# Altium schematic sheet 15_Debug接口.schdoc.schdoc
size A; Symbol: Sheet-Symbol_A4; Device: Sheet-Symbol_A4; Company: 嘉立创EDA; Version: V1.0; Page Size: A4; @Project Name: RK3568底板_V1.2; @Page Count: 6; @Update Date: 2024-04-19; @Create Date: 2024-04-18; @Schematic Name: 原理图; @Page No: 3; @Page Name: 外设接口
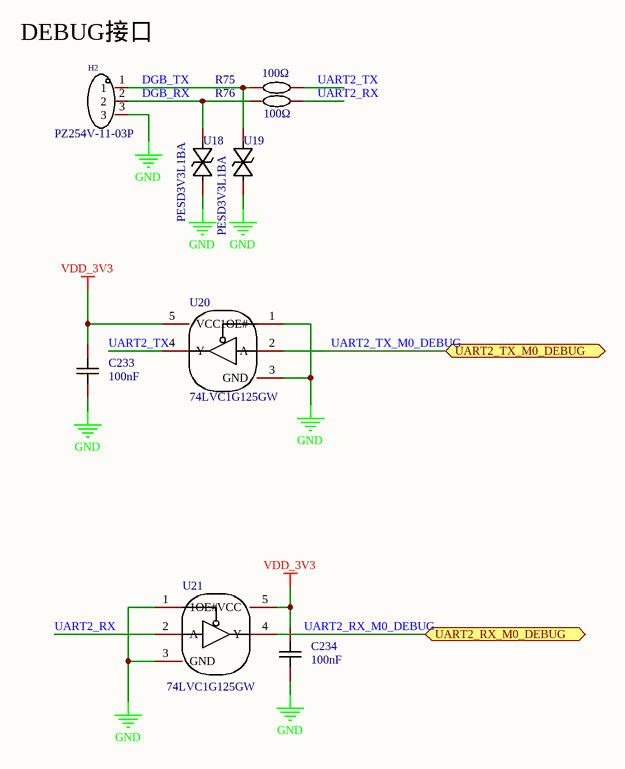
[diagram p0: 15_Debug接口.schdoc.schdoc]

## Parts
C233  100nF  [C0603]
C234  100nF  [C0603]
H2  PZ254V-11-03P  [HDR-TH_3P-P2.54-V-M]
R75  100Ω  [R0603]
R76  100Ω  [R0603]
U18  PESD3V3L1BA  [SOD-323_L1.7-W1.3-LS2.6-BI]
U19  PESD3V3L1BA  [SOD-323_L1.7-W1.3-LS2.6-BI]
U20  Name: 74LVC1G125GW  [SOT-353_L2.1-W1.3-P0.65-LS2.3-BR]  (hidden comment: 74LVC1G125GW,125)
U21  74LVC1G125GW  [SOT-353_L2.1-W1.3-P0.65-LS2.3-BR]

## Ports
UART2_RX_M0_DEBUG (bidir), UART2_TX_M0_DEBUG (bidir)

## Nets
GND: C233.1 C234.1 H2.3 U18.1 U19.1 U20.1(1OE#) U20.3(GND) U21.1(1OE#) U21.3(GND)
VDD_3V3: C233.2 C234.2 U20.5(VCC) U21.5(VCC)
DGB_RX: H2.2 R76.1 U18.2
DGB_TX: H2.1 R75.1 U19.2
UART2_RX: R76.2 U21.2(A)
UART2_RX_M0_DEBUG: U21.4(Y) ; port UART2_RX_M0_DEBUG
UART2_TX: R75.2 U20.4(Y)
UART2_TX_M0_DEBUG: U20.2(A) ; port UART2_TX_M0_DEBUG

## Notes on the sheet
- (near H2) DEBUG接口
- 1
- 2
- 3
- 4
- 5
- 6
- A
- B
- C
- 原理图
- 创建日期
- 更新日期
- 2024-04-19
- 2024-04-18
- 审阅
- 绘制
- 图页
- 外设接口
- 物料编码
- RK3568底板_V1.2
- D
- 版本
- 尺寸
- 页
- 共
- V1.0
- A4
- 嘉立创EDA

## Library data of the parts
C233 C234 = CC0603KRX7R9BB104: Manufacturer: YAGEO(国巨); Add into BOM: yes; Tolerance: ±10%; Voltage Rated: 50V; Temperature Coefficient: X7R; Name: 100nF; Symbol: CC0603KRX7R9BB104; Device: CC0603KRX7R9BB104; Supplier: LCSC; Manufacturer Part: CC0603KRX7R9BB104; Value: 100nF; Supplier Part: C14663; JLCPCB Part Class: 基础库; LCSC Part Name: 100nF ±10% 50V; Supplier Footprint: 0603; Datasheet: https://atta.szlcsc.com/upload/public/pdf/source/20180910/C282072_33301C7F631E79921B82A8DAC6BCC5B3.pdf; Convert to PCB: yes
H2 = PZ254V-11-03P: Manufacturer: XFCN(兴飞); Symbol: PZ254V-11-03P_C2937625; Add into BOM: yes; Pin Structure: 1x3P; Pitch: 2.54mm; Circluar Pins/Square Pins: 方针; Current Rating (Max): 3A; Voltage Rating (Max): 250V; Name: PZ254V-11-03P; Device: PZ254V-11-03P; Supplier: LCSC; Supplier Part: C2937625; Manufacturer Part: PZ254V-11-03P; JLCPCB Part Class: 扩展库; LCSC Part Name: 间距:2.54mm 1x3P 直插 方针; Supplier Footprint: 插件,P=2.54mm; Datasheet: https://atta.szlcsc.com/upload/public/pdf/source/20200309/C492402_8335C3D49C4E4C618838D59BB1D024C1.pdf; Convert to PCB: yes; Row Spacing: -; Mounting Type: 直插; Number of Rows: 单排; Number of Pins: 3P; Length of Mating Pin: 6mm; Insulation Height: 2.5mm; Length of End Connection Pin: 3mm; Operating Temperature Range: -40℃~+105℃; Color: 黑色
R75 R76 = 0603WAF1000T5E: Manufacturer: UNI-ROYAL(厚声); Add into BOM: yes; Tolerance: ±1%; Power(Watts): 100mW; Overload Voltage (Max): 75V; Temperature Coefficient: ±200ppm/℃; Name: 100Ω; Symbol: 0603WAF1000T5E; Device: 0603WAF1000T5E; LCSC Part Name: 100Ω ±1% 100mW 厚膜电阻; Supplier Part: C22775; Manufacturer Part: 0603WAF1000T5E; Supplier Footprint: 0603; JLCPCB Part Class: 基础库; Datasheet: https://atta.szlcsc.com/upload/public/pdf/source/20200306/C422600_1E6D84923E4A46A82E41ADD87F860B5C.pdf; Supplier: LCSC; Convert to PCB: yes; Type: 厚膜电阻; Value: 100Ω; Operating Temperature Range: -55℃~+155℃
U18 U19 = PESD3V3L1BA_C2687129: Manufacturer: UMW(友台半导体); Add into BOM: yes; Name: PESD3V3L1BA; Symbol: PESD3V3L1BA_C2687129; Device: PESD3V3L1BA_C2687129; LCSC Part Name: PESD3V3L1BA; Supplier Part: C2687129; Manufacturer Part: PESD3V3L1BA; Supplier Footprint: SOD-323; JLCPCB Part Class: 扩展库; Datasheet: https://atta.szlcsc.com/upload/public/pdf/source/20231109/93EB786E66E91E2C792027BF9B7AC5FE.pdf; Supplier: LCSC; Convert to PCB: yes; Type: ESD
U20 U21 = 74LVC1G125GW,125: Manufacturer: Nexperia(安世); Add into BOM: yes; output type: 三态; Supply Voltage: 1.65V~5.5V; Number of Elements: 1; Sink Current: 32mA; Logic Family: 74LVC; Symbol: 74LVC1G125GW,125; Device: 74LVC1G125GW,125; LCSC Part Name: 74LVC1G125GW,125; Supplier Part: C12519; Manufacturer Part: 74LVC1G125GW,125; Supplier Footprint: SOT-353; JLCPCB Part Class: 扩展库; Datasheet: https://atta.szlcsc.com/upload/public/pdf/source/20130521/1457706602470.pdf; Supplier: LCSC; Convert to PCB: yes; Input type: -; Number of Bits per Element: 1; Source Current: 32mA; Operating Temperature: -40℃~+125℃
  U21: Name: 74LVC1G125GW